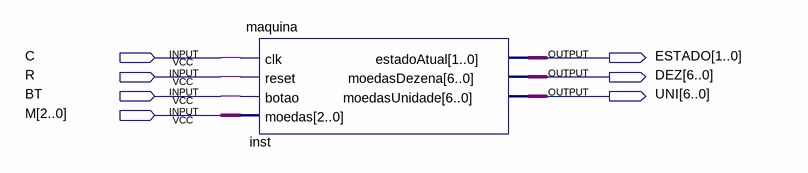
[diagram p0: schematic sheet]
// Quartus schematic mvendas.bdf as structural Verilog: 1 symbols, 7 pins
module mvendas (
  input  C,
  input  R,
  input  BT,
  input  [2:0] M,
  output [1:0] ESTADO,
  output [6:0] DEZ,
  output [6:0] UNI
);

  maquina inst (
    .clk(C), .reset(R), .botao(BT), .moedas(M), .estadoAtual(ESTADO), .moedasDezena(DEZ), .moedasUnidade(UNI));
endmodule
